# Altium schematic sheet Cover.SchDoc: ALTAIR
size A3; SheetNumber: 1; SheetTotal: 11
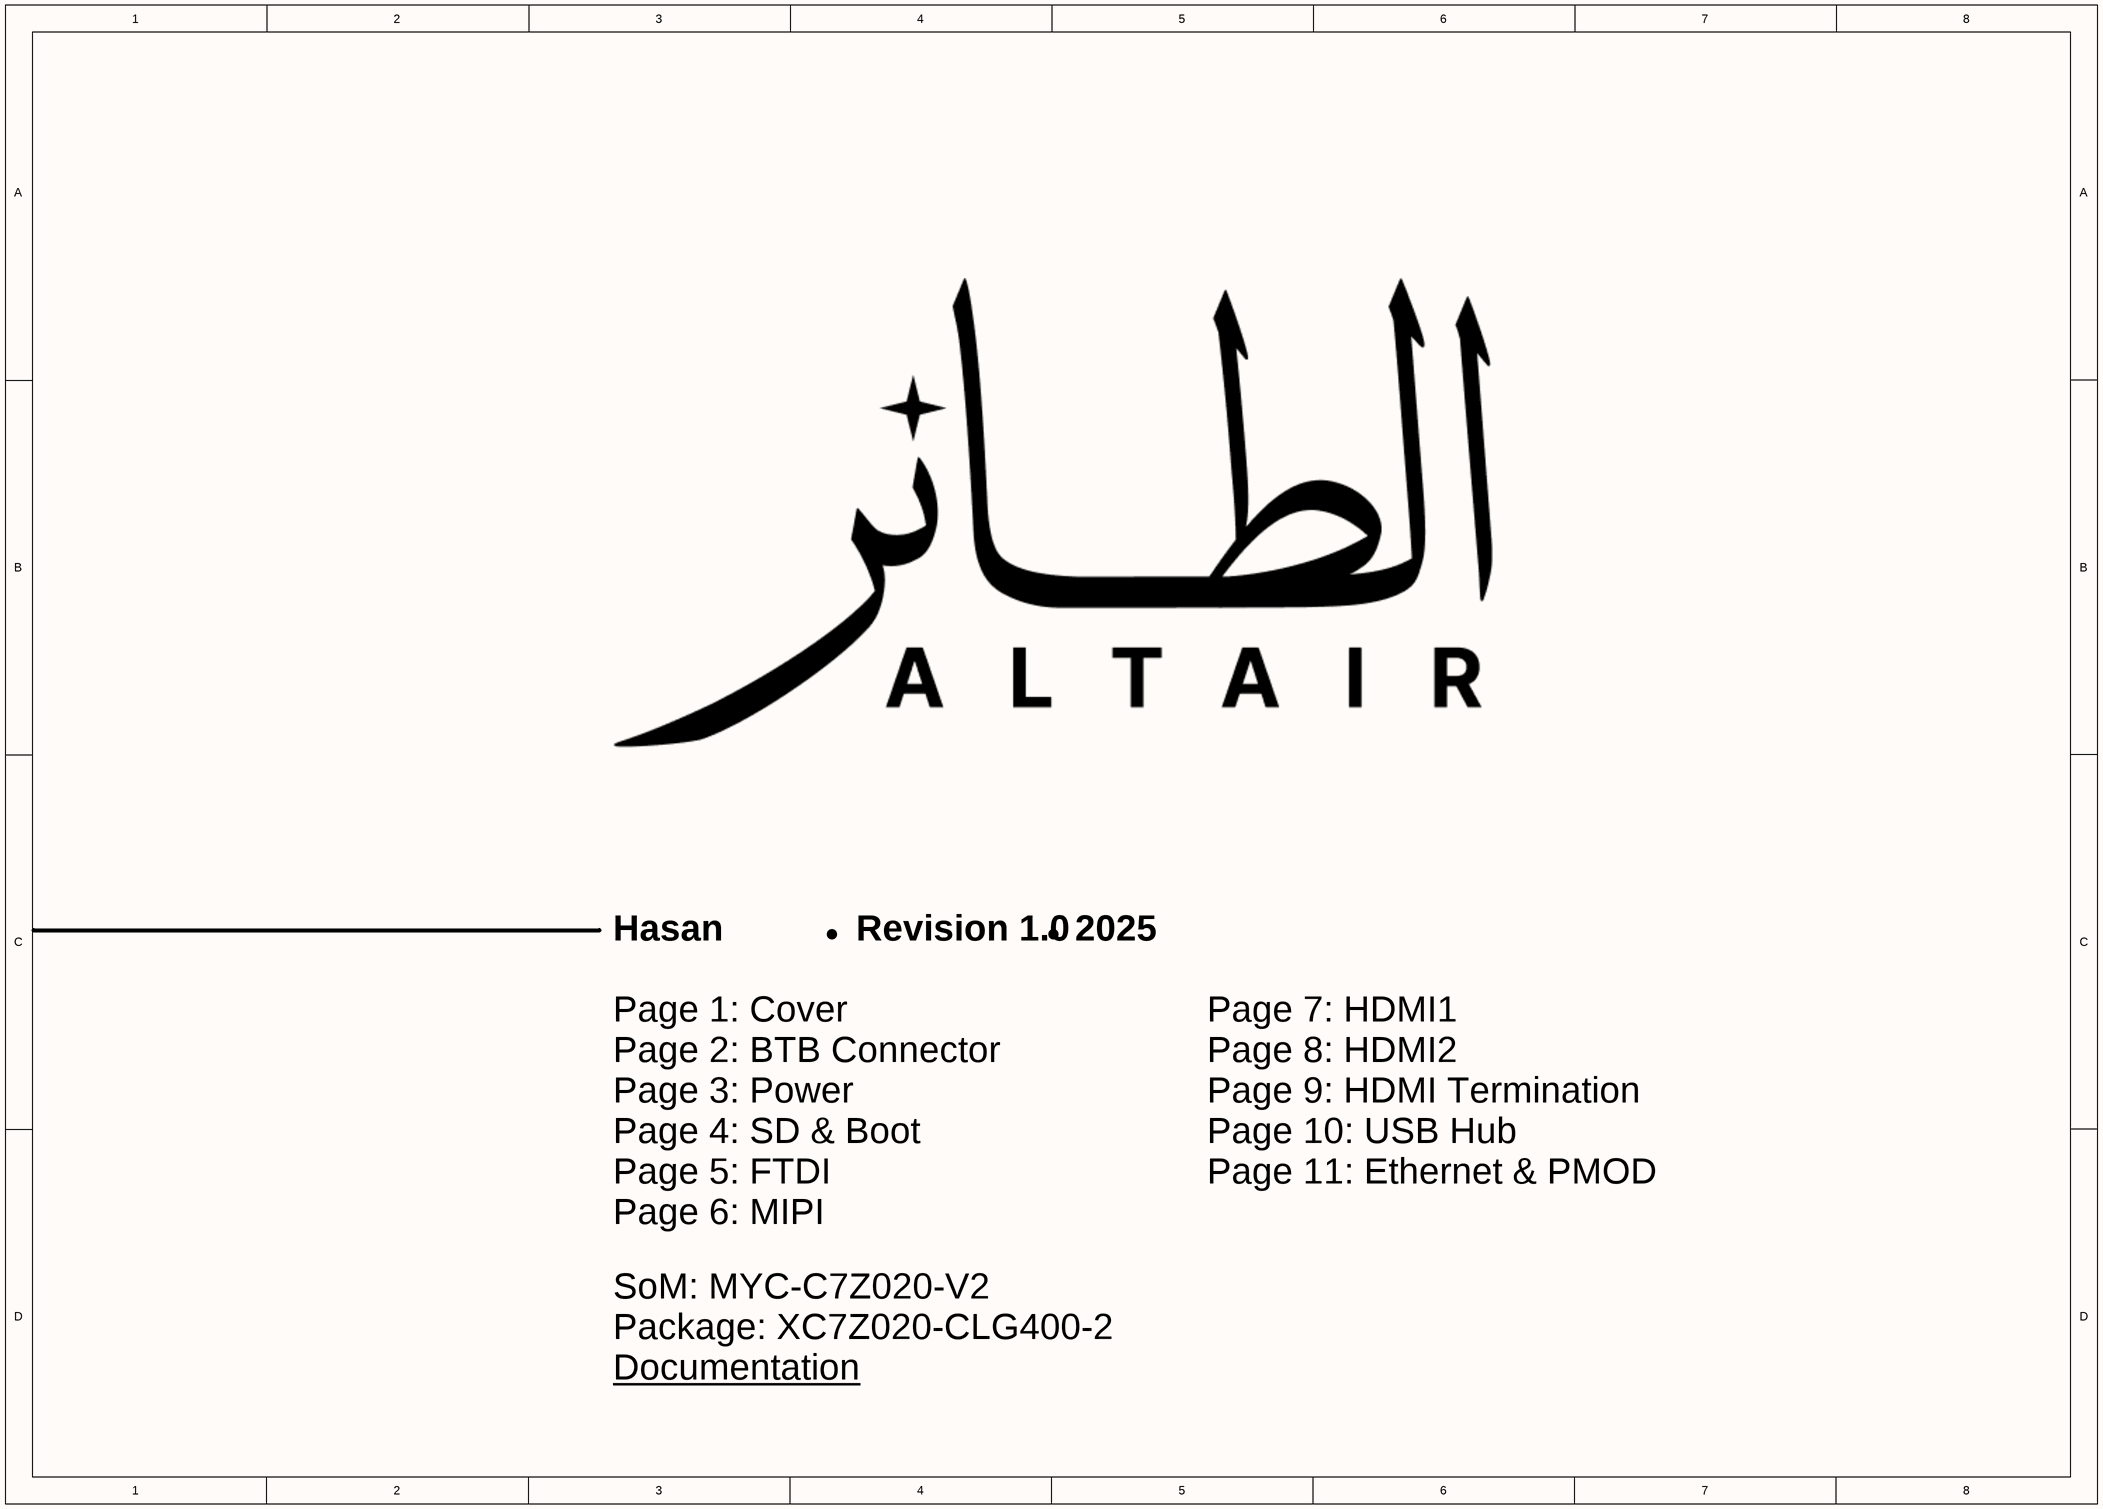
[diagram p0: Cover.SchDoc]

## Notes on the sheet
- Hasan
- ·
- Revision 1.0
- 2025
- Page 1: Cover
- Page 7: HDMI1
- Page 2: BTB Connector
- Page 3: Power
- Page 8: HDMI2
- Page 9: HDMI Termination
- Page 4: SD & Boot
- Page 5: FTDI
- Page 10: USB Hub
- Page 11: Ethernet & PMOD
- Page 6: MIPI
- SoM: MYC-C7Z020-V2
- Package: XC7Z020-CLG400-2
- Documentation <https://github.com/HasanTheSyrian/ALTAIR>
- THIS DOCUMENT AND THE DATA DISCLOSED HEREIN OR
- HEREWITH IS THE PROPERTY OF ALTIUM LIMITED AND MAY
- DWG NO:
- REVISION
- REV:
- DESCRIPTION
- DATE
- APPROVED
- BE FREELY DISTRIBUTED IN WHOLE. NO RIGHTS ARE
- RESERVED OR EXPRESS OR IMPLIED WARANTEE GIVEN.
- ENG:
- APPROVALS
- PROJECT
- DSN:
- CHK:
- REFERENCE DOCUMENTS
- PROJECT REVISION:
- TITLE
- DOCUMENT REVISION:
- DESIGN ITEM:
- BOM:
- FAB DWG:
- PCB DWG:
- ASSY DWG:
- SCALE:
- A3
- SIZE
- CAGE CODE
- FILE NAME
- DWG NO.
- SHEET
- OF
- REV